# Altium schematic sheet fpga-outside.SchDoc
size Letter; CheckedBy: E. Chiu; CompanyName: Brinton Engineering, LLC; DrawnBy: J. Brinton; Engineer: J. Brinton; Address1: 3479 Edison Way; Address2: Menlo Park CA 94025; Address3: +1 (877) 778-8435; Address4: brintonengineering.com; Revision: 1; SheetNumber: 7; SheetTotal: 48
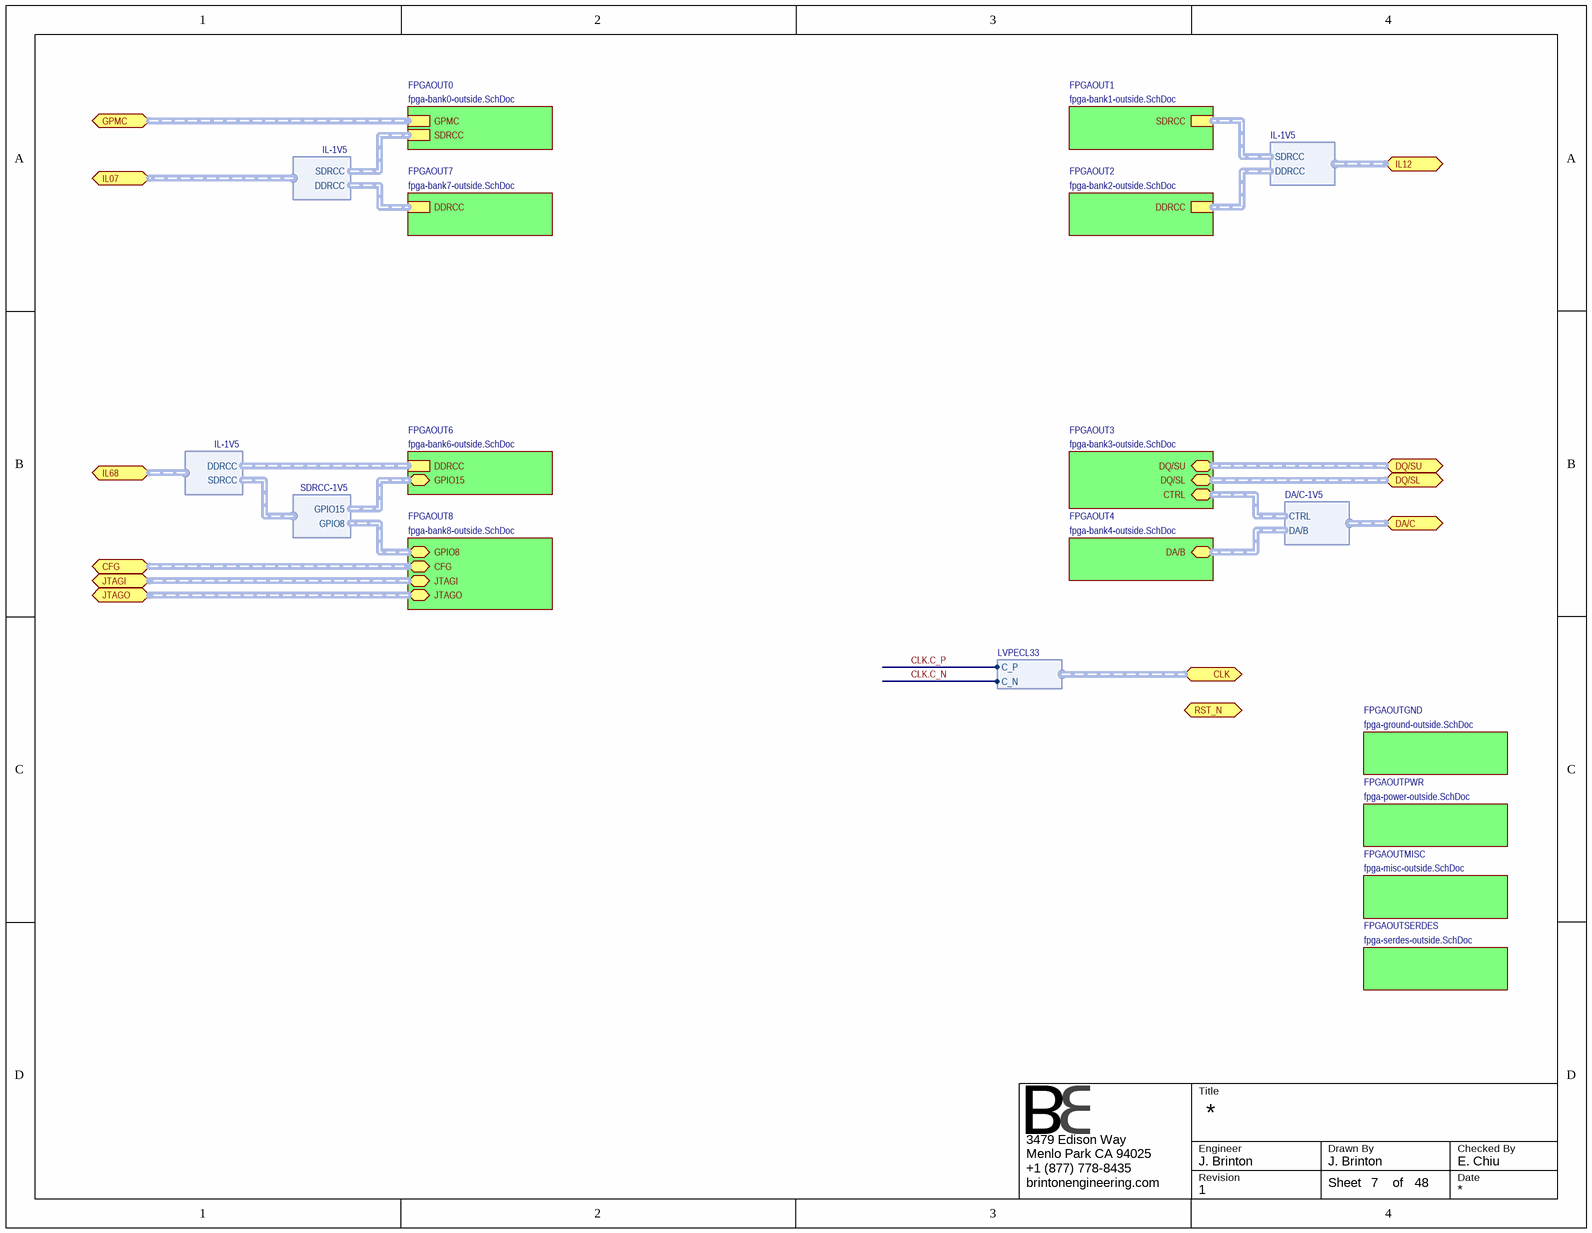
[diagram p0: fpga-outside.SchDoc]

## Sub-sheets
FPGAOUT0 = fpga-bank0-outside.SchDoc: GPMC (harness GPMC), SDRCC (harness SDRCC-1V5)
FPGAOUT1 = fpga-bank1-outside.SchDoc: SDRCC (harness SDRCC-1V5)
FPGAOUT2 = fpga-bank2-outside.SchDoc: DDRCC (harness DDRCC-1V5)
FPGAOUT3 = fpga-bank3-outside.SchDoc: CTRL (harness CTRL-1V5), DQ/SU (harness DQ/S-1V5), DQ/SL (harness DQ/S-1V5)
FPGAOUT4 = fpga-bank4-outside.SchDoc: DA/B (harness DA/B-1V5)
FPGAOUT6 = fpga-bank6-outside.SchDoc: DDRCC (harness DDRCC-1V5), GPIO15 (harness GPIO15-1V5)
FPGAOUT7 = fpga-bank7-outside.SchDoc: DDRCC (harness DDRCC-1V5)
FPGAOUT8 = fpga-bank8-outside.SchDoc: CFG (harness CFG-1V5), GPIO8 (harness GPIO8-1V5), JTAGI (harness JTAG-1V5), JTAGO (harness JTAG-1V5)
FPGAOUTGND = fpga-ground-outside.SchDoc: no entries
FPGAOUTMISC = fpga-misc-outside.SchDoc: no entries
FPGAOUTPWR = fpga-power-outside.SchDoc: no entries
FPGAOUTSERDES = fpga-serdes-outside.SchDoc: no entries

## Ports
CFG (harness CFG-1V5), CLK (harness LVPECL33), DA/C (harness DA/C-1V5), DQ/SL (harness DQ/S-1V5), DQ/SU (harness DQ/S-1V5), GPMC (harness GPMC), IL07 (harness IL-1V5), IL12 (harness IL-1V5), IL68 (harness IL-1V5), JTAGI (harness JTAG-1V5), JTAGO (harness JTAG-1V5), RST_N (in)

## Harnesses
IL-1V5: DDRCC, SDRCC
SDRCC-1V5: GPIO15, GPIO8
DA/C-1V5: DA/B, CTRL
LVPECL33: C_P, C_N

## Nets
CLK.C_N: port CLK.C_N
CLK.C_P: port CLK.C_P

## Buses and harness runs
harness port CFG = sheet FPGAOUT8/CFG
harness port DQ/SL = sheet FPGAOUT3/DQ/SL
harness port DQ/SU = sheet FPGAOUT3/DQ/SU
harness port GPMC = sheet FPGAOUT0/GPMC
harness port JTAGI = sheet FPGAOUT8/JTAGI
harness port JTAGO = sheet FPGAOUT8/JTAGO

## Notes on the sheet
- Title
- Engineer
- Revision
- Drawn By
- Checked By
- Date
- Sheet
- of